# EAGLE schematic wyrbondr (EAGLE 6.1)
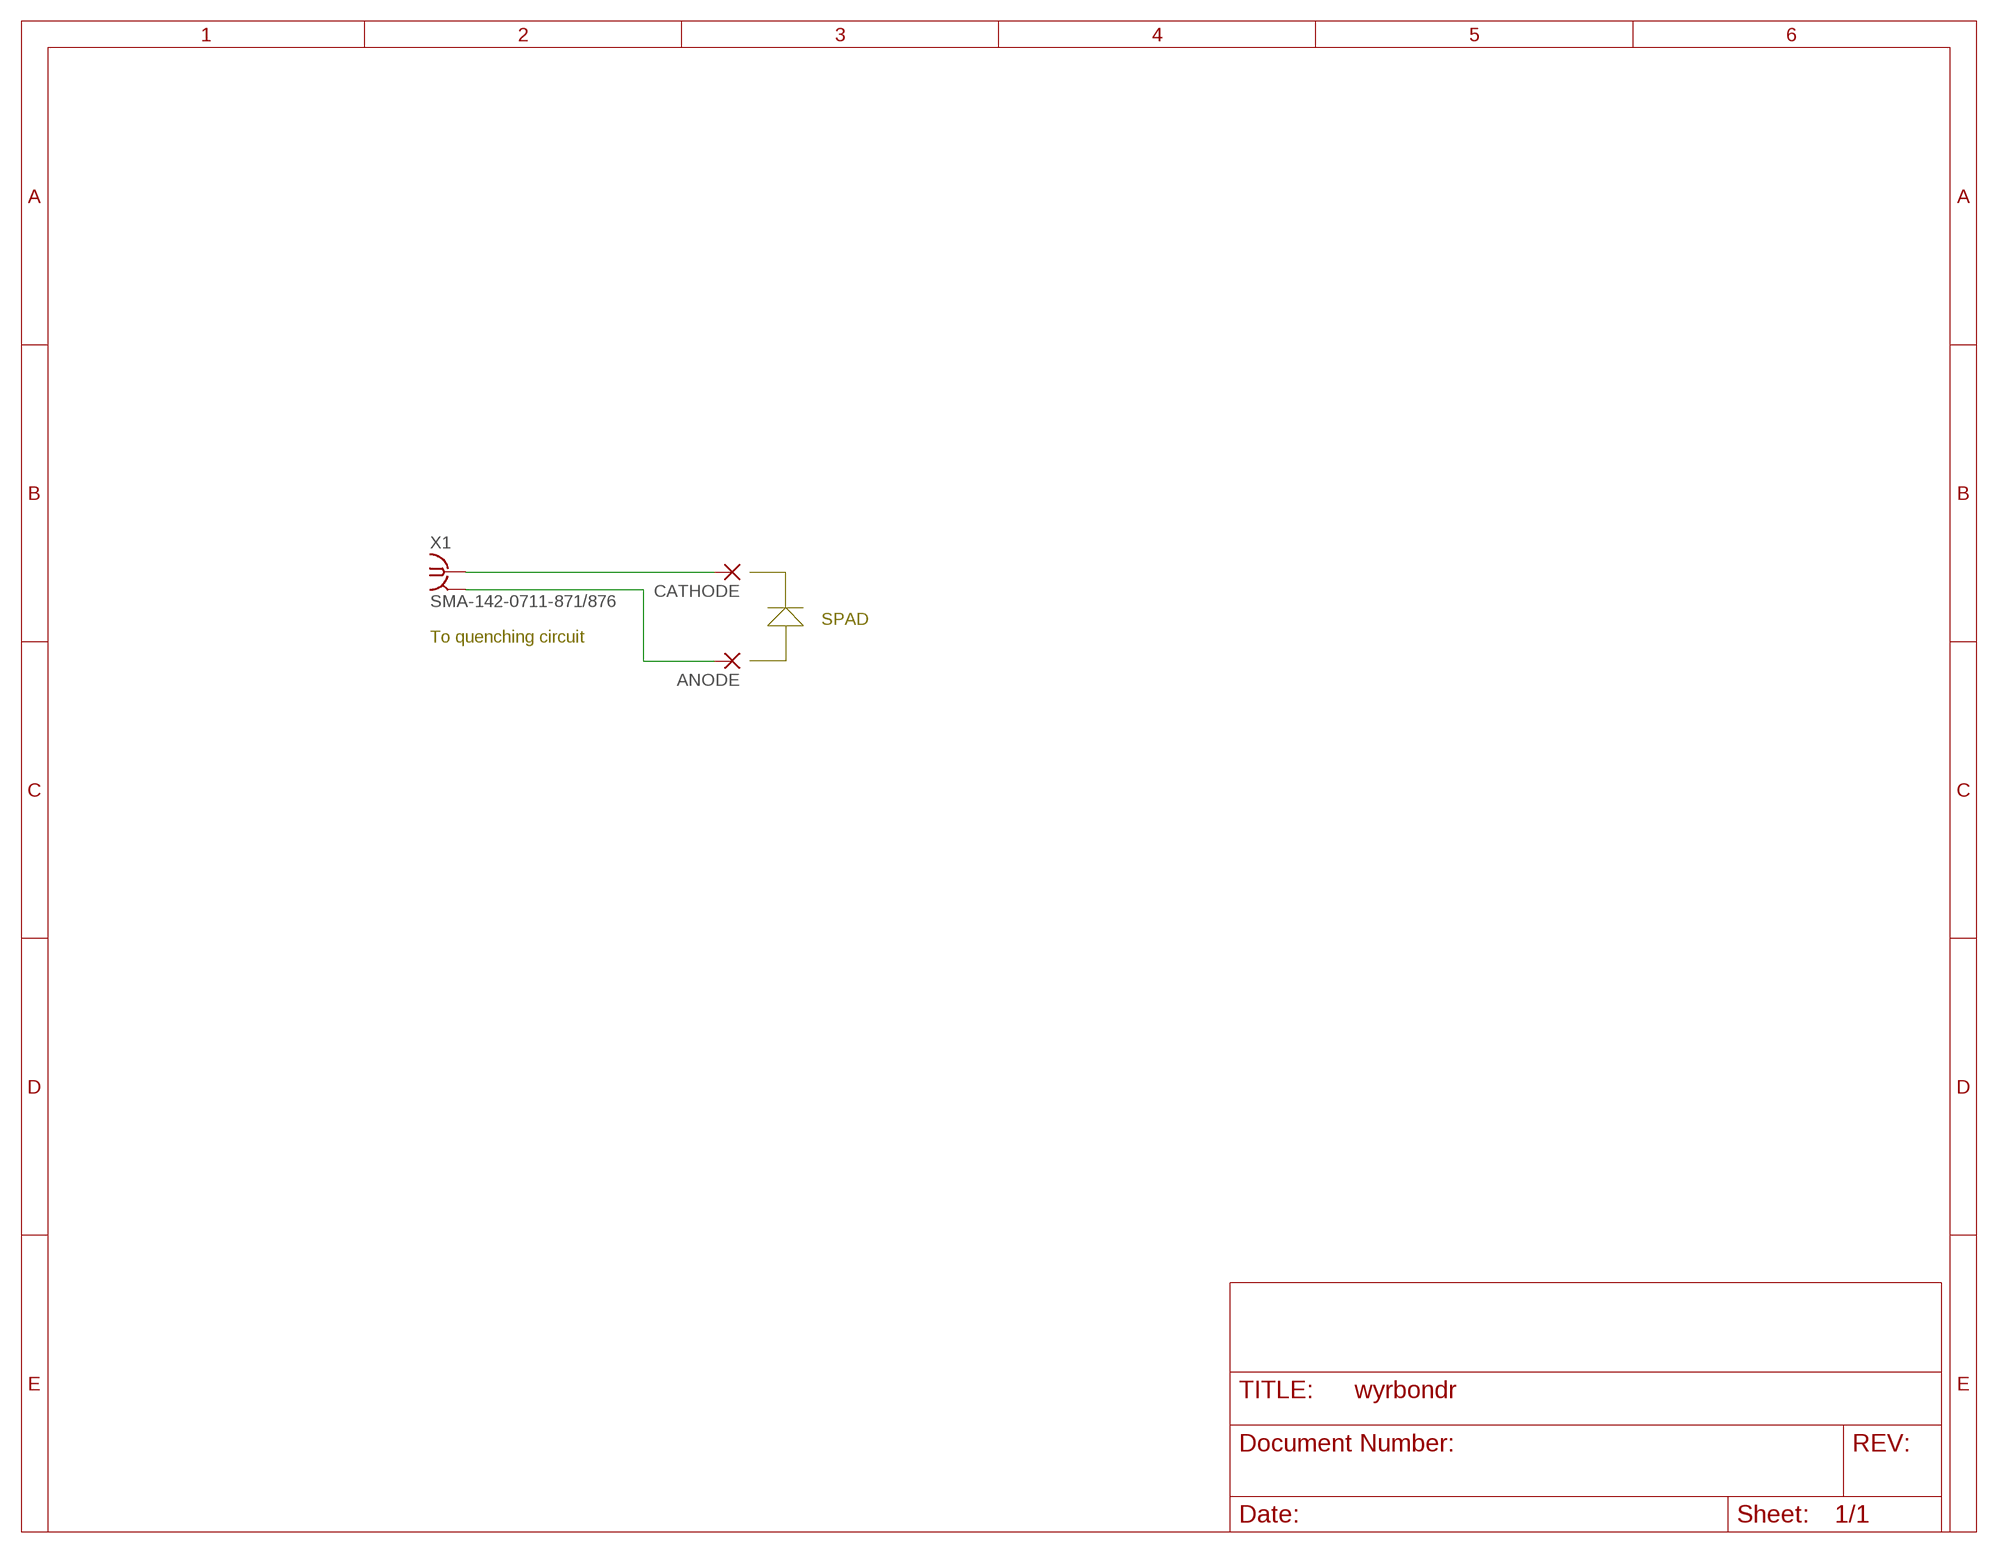
[diagram p0: schematic, sheet 1]

## Parts
ANODE  SMD2  [SMD1,27-2,54]
CATHODE  SMD2  [SMD1,27-2,54]
X1  SMA-142-0711-871/876  [J502-ND-142-0711-871/876]

## Nets
CATHODE: CATHODE.1(P) X1.1
GND: ANODE.1(P) X1.G@1(GND)

## Notes on the sheet
- SPAD
- To quenching circuit

## Power pins joined to a net without a drawn wire
GND: X1.G@2(GND) X1.G@3(GND) X1.G@4(GND)

## Library data of the parts
ANODE CATHODE = wirepad:SMD2: SMD PAD
X1 = con-coax:SMA-: SMA 50 Ohm End Launch Jack Receptacle - Round Contact Johnson Components Source: www.johnsoncomponents.com .. J502-ND.pdf; MF: JOHNSON COMPONENTS; MPN: 142-0711-871; OC_FARNELL: unknown; OC_NEWARK: 01C1639